# Altium schematic sheet controller.SchDoc: Controller
size A4; Author: Csorvasi Gabor; CompanyName: BME-AUT; Organization: BME AUT; Address1: Magyar tudósok krt. 2.; Address2: Q épület; Address3: Budapest; Address4: H-1117; DocumentNumber: 1; Revision: v1.0; SheetNumber: 1; SheetTotal: 2
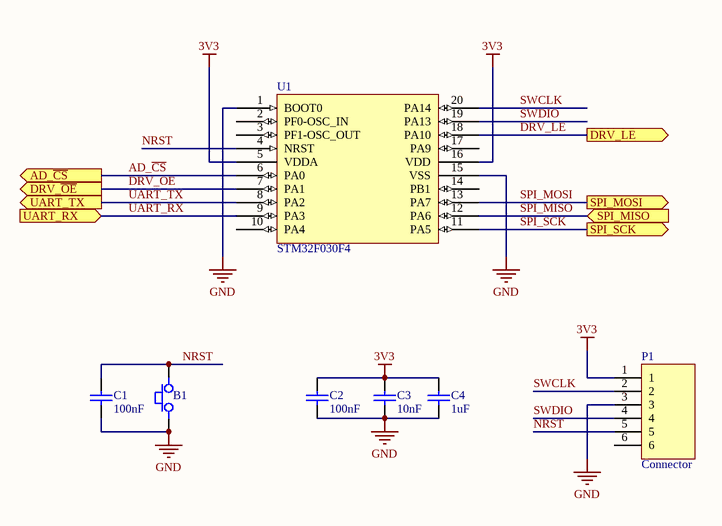
[diagram p0: controller.SchDoc]

## Parts
B1  Button  [FP_BTN_SMD_3x6]  (value not drawn)
C1  100nF  [FP_0805_CAP_085]
C2  100nF  [FP_0805_CAP_085]
C3  10nF  [FP_0805_CAP_085]
C4  1uF  [FP_0805_CAP_085]
P1  Connector  [FP_CONN6_TAP_254MM]
U1  STM32F030F4  [TSOP65P640X120-20M]

## Ports
AD_~{CS} (out), DRV_LE (out), DRV_~{OE} (out), SPI_MISO (in), SPI_MOSI (out), SPI_SCK (out), UART_RX (in), UART_TX (out)

## Nets
3V3: C2.2 C3.2 C4.2 P1.1 U1.5(VDDA) U1.16(VDD)
GND: B1.1 C1.1 C2.1 C3.1 C4.1 P1.3 U1.1(BOOT0) U1.15(VSS)
AD_~{CS}: U1.6(PA0) ; port AD_~{CS}
DRV_LE: U1.18(PA10) ; port DRV_LE
DRV_~{OE}: U1.7(PA1) ; port DRV_~{OE}
NRST: B1.2 C1.2 P1.5 U1.4(NRST)
SPI_MISO: U1.12(PA6) ; port SPI_MISO
SPI_MOSI: U1.13(PA7) ; port SPI_MOSI
SPI_SCK: U1.11(PA5) ; port SPI_SCK
SWCLK: P1.2 U1.20(PA14)
SWDIO: P1.4 U1.19(PA13)
UART_RX: U1.9(PA3) ; port UART_RX
UART_TX: U1.8(PA2) ; port UART_TX

Not connected (* = marked no-connect by the designer): P1 6; U1 2(PF0-OSC_IN) 3(PF1-OSC_OUT) 10(PA4) 14(PB1) 17(PA9)

## Notes on the sheet
- Title
- Size:
- Date:
- A4
- Number:
- Time:
- Revision:
- Sheet
- of
- File:

## Library data of the parts
B1 = Button 2P: Push button; Name: TACT 3x 6 2P SPST 1 TS-363 (FEM) SMD 3.5x6mm H=4.3mm; Reference: 45-08-58; Supplier: Lomex
C1 C2 = CAP: Capacitor; Name: 100nF 0805 10% 50V X7R 0805B104K500CT (WAL); Supplier: Lomex; Reference: 82-10-76; Value: 100nF
C3 = CAP: Capacitor; Name: 10nF 0805 10% 50V X7R 0805B103K500NT (FNG); Supplier: Lomex; Reference: 82-13-45; Value: 10nF
C4 = CAP: Capacitor; Name: 1uF 0805 -20+80% 50V Y5V 0805F105Z500CT (WAL); Supplier: Lomex; Reference: 82-11-42; Value: 1uF
P1 = Connector_6pin: 6pin connector; Name: TÁPCSATL. 2.54mm 6P APA 180° NCW254-06S (G-S) FORR.; Supplier: Lomex; Reference: 43-08-99
U1 = STM32F030F4: Reference: 2432084; Name: STM32F030F4P6TR -  ARM MCU, Value Line; Supplier: Farnell